# EAGLE schematic Teensy4.0 w CAN BUS (EAGLE 9.6.1)
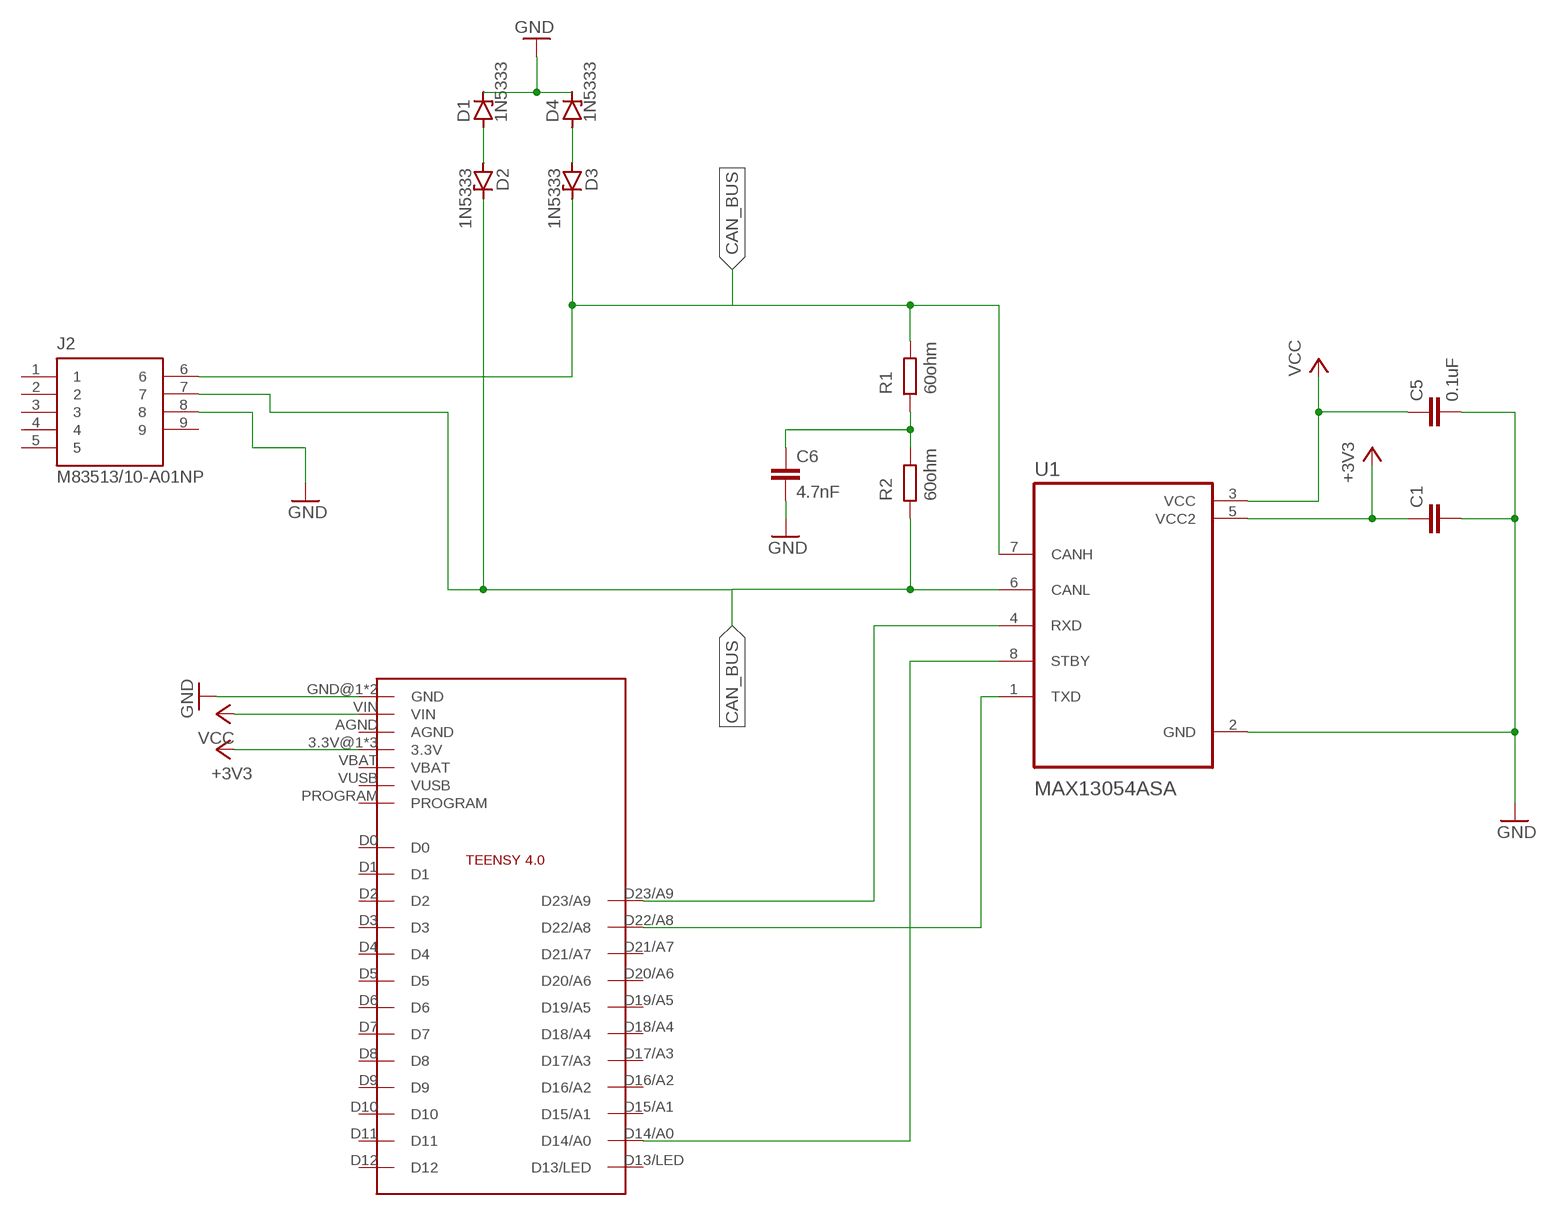
[diagram p0: schematic, sheet 1]

## Parts
C1  C2,5-3  [C2.5-3]
C5  0.1uF  C2,5-3  [C2.5-3]
C6  4.7nF  C2,5-3  [C2.5-3]
D1  1N5333  [C1702-15]
D2  1N5333  [C1702-15]
D3  1N5333  [C1702-15]
D4  1N5333  [C1702-15]
J2  M83513/10-A01NP  [BEL_M83513/10-A01NP]
R1  60ohm  R  (no package)
R2  60ohm  R  (no package)
U1  MAX13054ASA  [SOIC127P600X175-8N]
U$1  TEENSY4.0  [TEENSY4.0]

## Nets
+3V3: C1.1 U1.5(VCC2) U$1.3.3V@1(3.3V) U$1.3.3V@2(3.3V) U$1.ON/OFF(3.3V)
CAN_BUS: D3.C J2.6 R1.2 U1.7(CANH)
GND: C1.2 C5.2 C6.2 D1.C D4.C J2.8 U1.2(GND) U$1.GND@1(GND) U$1.GND@2(GND)
N$1: U1.4(RXD) U$1.D23/A9
N$2: U1.1(TXD) U$1.D22/A8
N$3: U1.8(STBY) U$1.D14/A0
N$4: D1.A D2.A
N$5: D2.C J2.7 R2.1 U1.6(CANL)
N$6: C6.1 R1.1 R2.2
N$7: D3.A D4.A
VCC: C5.1 U1.3(VCC) U$1.VIN
Unconnected: J2.1 J2.2 J2.3 J2.4 J2.5 J2.9 U$1.AGND U$1.D0 U$1.D1 U$1.D2 U$1.D3 U$1.D4 U$1.D5 U$1.D6 U$1.D7 U$1.D8 U$1.D9 U$1.D10 U$1.D11 U$1.D12 U$1.D13/LED U$1.D15/A1 U$1.D16/A2 U$1.D17/A3 U$1.D18/A4 U$1.D19/A5 U$1.D20/A6 U$1.D21/A7 U$1.PROGRAM U$1.VBAT U$1.VUSB

## Library data of the parts
C1 C5 C6 = capacitor-wima:C: CAPACITOR naming: grid - package width
D1-D4 = diode:1N5333: Z DIODE 3.3 V, 5W, 5 percent (Motorola)
J2 = M83513_10-A01NP:M83513/10-A01NP: MIL-DTL-83513 PCB Mounted Connector | Plug | 9 Positions | Shell Finish - Cadmium | Male | PCB Solder Pins | 0.109in (2.77 mm) Pin Length; AVAILABILITY: Unavailable; DESCRIPTION: MIL-DTL-83513 PCB Mounted Connector | Plug | 9 Positions | Shell Finish - Nickel | Male | PCB Solder Pins | 0.109 (2.77 mm) Pin Length | Jackpost Attached; MF: Cinch Connectivity Solutions; MP: M83513/10-A01NP; PACKAGE: None; PRICE: None
R1 R2 = ngspice-simulation:R: RESISTOR
U1 = MAX13054ASA:MAX13054ASA; DESCRIPTION: 1/1 Transceiver Full CANbus 8-SOIC; DIGI-KEY_PART_NUMBER: MAX13054ASA+TTR-ND; DIGI-KEY_PURCHASE_URL: https://www.digikey.com/product-detail/en/maxim-integrated/MAX13054ASA-T/MAX13054ASA-TTR-ND/1475460?utm_source=snapeda&utm_medium=aggregator&utm_campaign=symbol; MF: Maxim Integrated; MP: MAX13054ASA+; PACKAGE: SOIC-8 Maxim
U$1 = Teensy4.0:TEENSY4.0